# EAGLE design store-column-block (EAGLE 7.6.0)
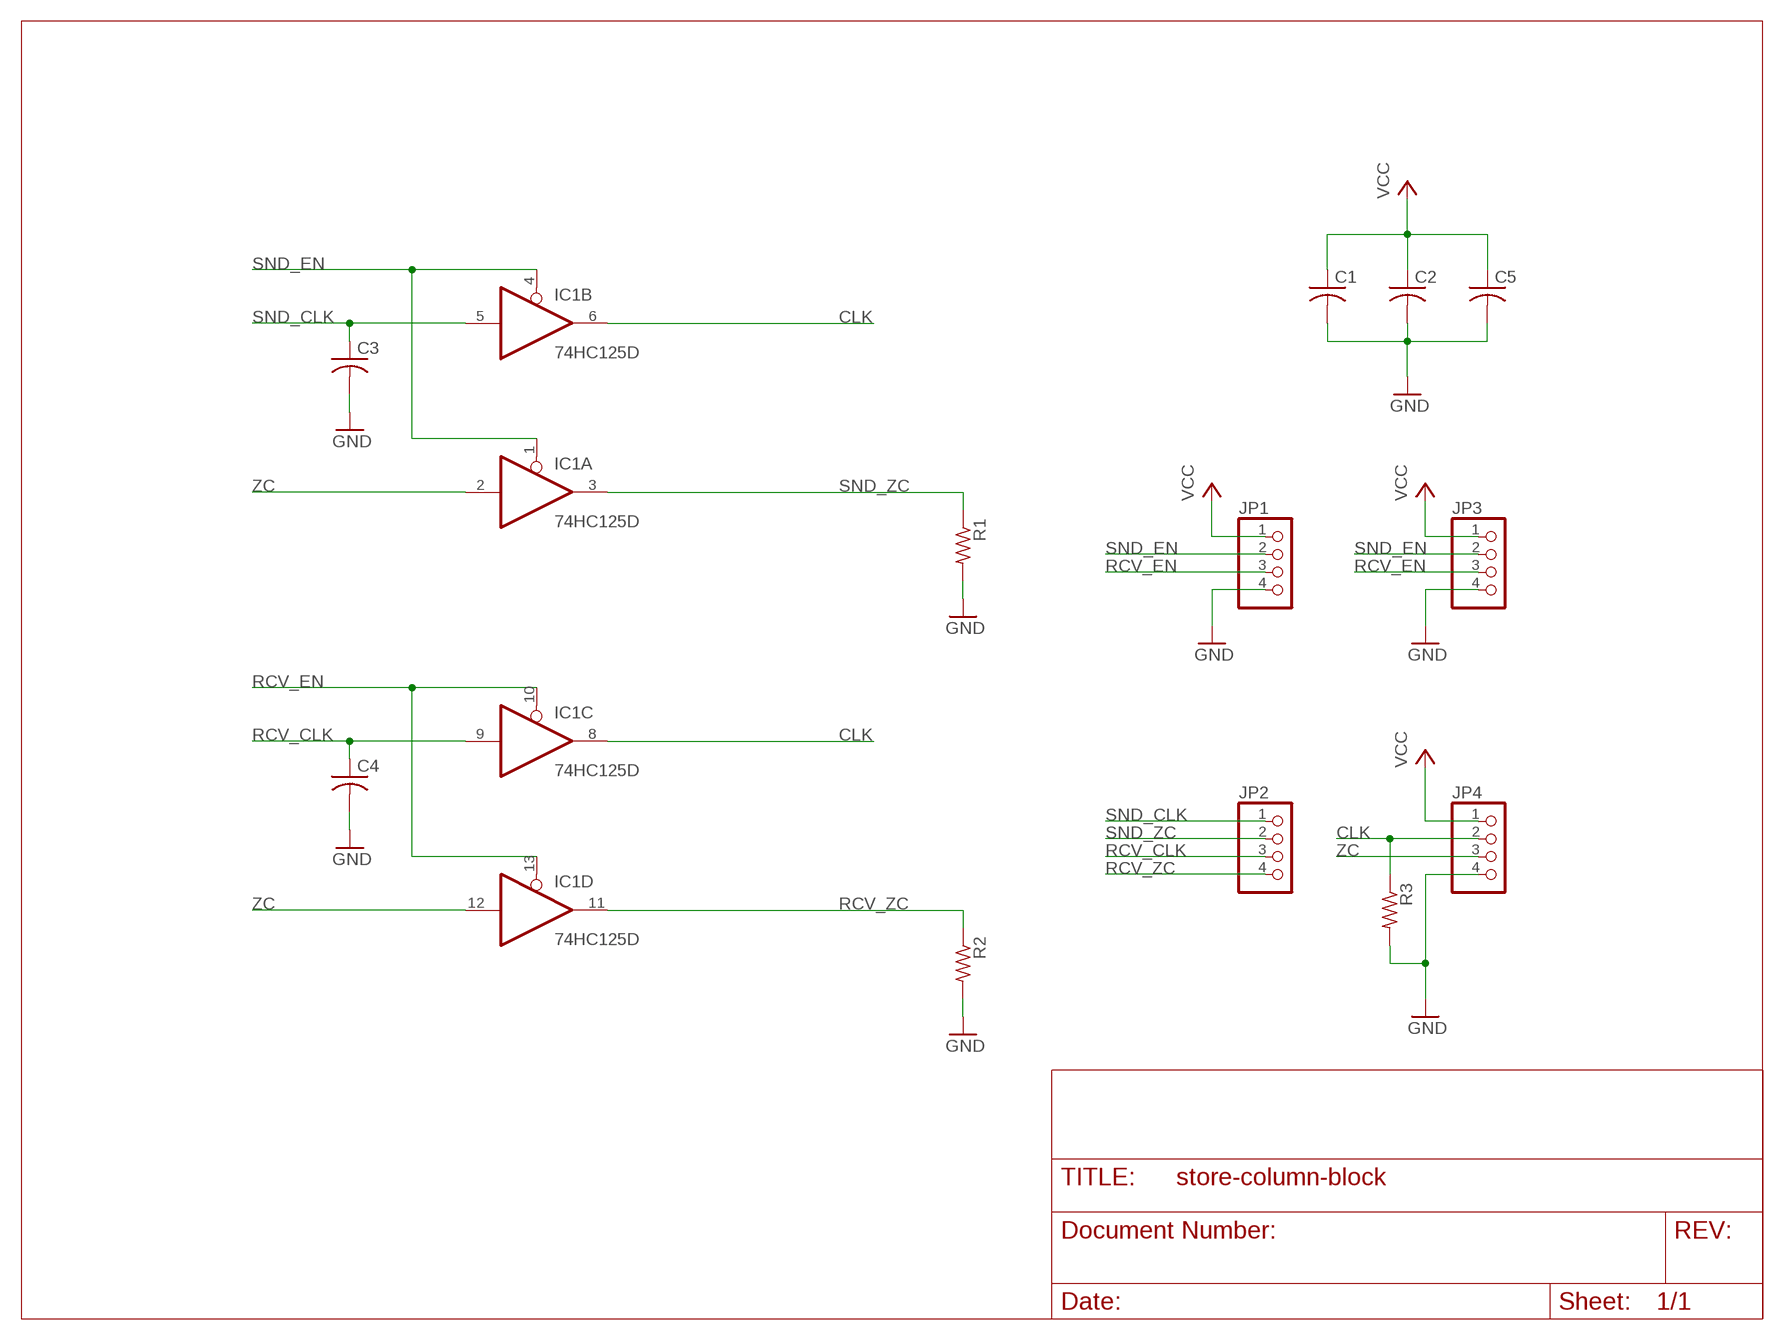
[diagram p0: schematic, sheet 1]

## Parts
C1  C-USC0603K  [C0603K]
C2  C-USC0603K  [C0603K]
C3  C-USC0603K  [C0603K]
C4  C-USC0603K  [C0603K]
C5  C-USC0603K  [C0603K]
IC1  74HC125D  [SO14]
JP1  PINHD-1X4  [1X04]
JP2  PINHD-1X4  [1X04]
JP3  PINHD-1X4  [1X04]
JP4  PINHD-1X4  [1X04]
R1  R-US_R0603  [R0603]
R2  R-US_R0603  [R0603]
R3  R-US_R0603  [R0603]

## Nets
CLK: IC1.6(B:O) IC1.8(C:O) JP4.2 R3.1
GND: C1.2 C2.2 C3.2 C4.2 C5.2 JP1.4 JP3.4 JP4.4 R1.2 R2.2 R3.2
RCV_CLK: C4.1 IC1.9(C:I) JP2.3
RCV_EN: IC1.10(C:OE) IC1.13(D:OE) JP1.3 JP3.3
RCV_ZC: IC1.11(D:O) JP2.4 R2.1
SND_CLK: C3.1 IC1.5(B:I) JP2.1
SND_EN: IC1.1(A:OE) IC1.4(B:OE) JP1.2 JP3.2
SND_ZC: IC1.3(A:O) JP2.2 R1.1
VCC: C1.1 C2.1 C5.1 JP1.1 JP3.1 JP4.1
ZC: IC1.2(A:I) IC1.12(D:I) JP4.3

## Power pins joined to a net without a drawn wire
GND: IC1.7(P:GND)
VCC: IC1.14(P:VCC)

## Library data of the parts
C1-C5 = resistor:C-US: CAPACITOR, American symbol
IC1 = 74xx-eu:74*125: Quad bus BUFFER, 3-state
JP1-JP4 = pinhead:PINHD-1X4: PIN HEADER
R1-R3 = resistor:R-US_: RESISTOR, American symbol

## Board
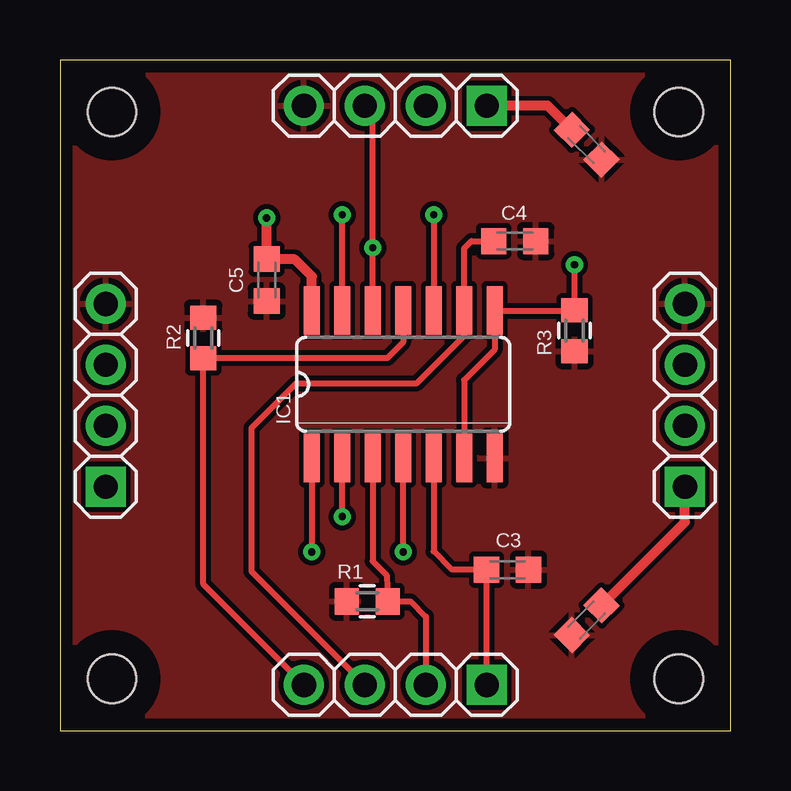
[diagram p1: board, top side]
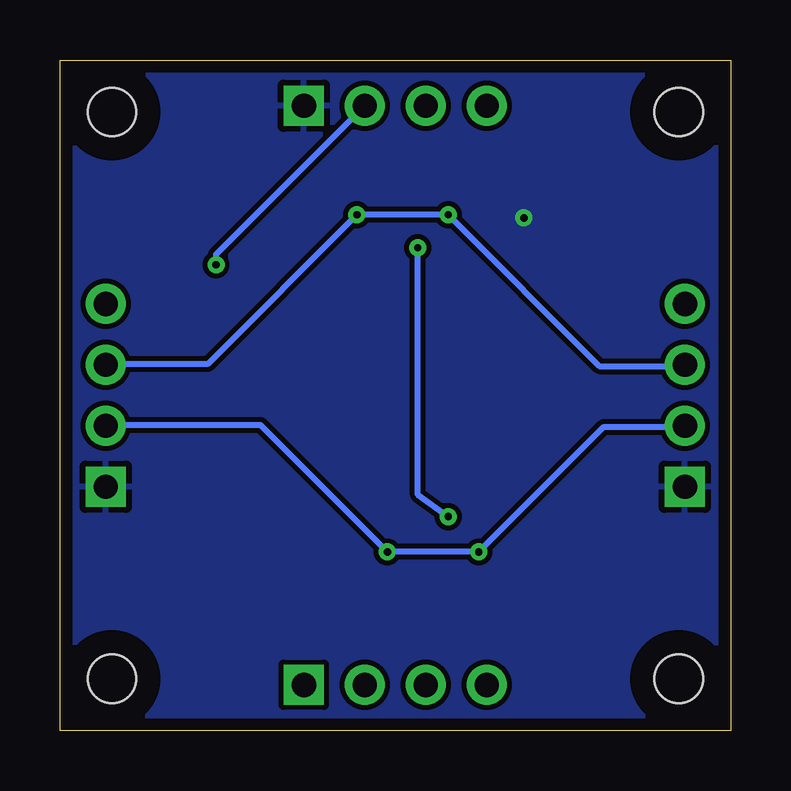
[diagram p2: board, bottom side, seen from below]

Size 27.94 x 27.94 mm. Coordinates in mm from the lower left corner, seen from the top.
Outline: 27.94,27.94 0,27.94 0,0 27.94,0 27.94,27.94
Copper layers (1*16): Top 0.035mm / dielectric 1.5mm / Bottom 0.035mm
Design rules "default *": minimum track width 8mil, minimum drill 12mil, track to track 8mil, track to pad 10mil, pad to pad 10mil, via to via 8mil, smd to smd 8mil, copper to edge 20mil, drill to drill 8mil, minimum pad ring 10mil, minimum via ring 8mil, stop-mask expansion 4mil, vias tented up to drill 0mil, thermal gap 10mil
Holes 2.01 mm at 2.16,2.16 25.78,2.16 25.78,25.78 2.16,25.78
tRestrict: area 23.8,0.2 to 27.8,4.2; area 23.8,23.8 to 27.8,27.8; area 0.2,23.8 to 4.2,27.8; area 0.2,0.2 to 4.2,4.2
bRestrict: area 23.8,0.2 to 27.8,4.2; area 23.8,23.8 to 27.8,27.8; area 0.2,23.8 to 4.2,27.8; area 0.2,0.2 to 4.2,4.2

### Footprints (pad centres in the part's own frame; a part is rotated, then mirrored left to right if it is on the bottom)
C0603K = smd 1.05 x 1.08: 1 -0.875,0; 2 0.875,0
SO14 = smd 0.66 x 2.032: 1 -3.81,-3.073; 2 -2.54,-3.073; 3 -1.27,-3.073; 4 0,-3.073; 5 1.27,-3.073; 6 2.54,-3.073; 7 3.81,-3.073; 8 3.81,3.073; 9 2.54,3.073; 10 1.27,3.073; 11 0,3.073; 12 -1.27,3.073; 13 -2.54,3.073; 14 -3.81,3.073
1X04 = drill 1.016 pad 1.676 square: 1 -3.81,0 | drill 1.016 pad 1.676: 2 -1.27,0; 3 1.27,0; 4 3.81,0
R0603 = smd 1 x 1.1: 1 -0.85,0; 2 0.85,0

### Placement (x,y rotation side)
C1  21.95,4.6 225 top
C2  21.95,24.41 315 top
C3  18.64,6.71 0 top
C4  18.95,20.4 0 top
C5  8.61,18.77 270 top
IC1  14.3,14.43 0 top
JP1  1.91,13.97 90 top
JP2  13.97,1.91 180 top
JP3  26.04,13.97 90 top
JP4  13.97,26.04 180 top
R1  12.8,5.38 180 top
R2  5.97,16.36 90 top
R3  21.44,16.66 270 top

### Tracks (layer width: path | path; a pad name or v marks a point on that pad's centre or on a via)
CLK  (via drill 0.3)
  Top 0.254: IC1.6 16.84,14.61 18.11,15.88 IC1.8 21.43,17.5 R3.1 v21.44,19.41
  Bottom 0.254: v21.44,19.41 21.44,19.84 JP4.2
GND
  pour Top: 27.69,0.25 0.25,0.25 0.25,27.69 27.69,27.69
RCV_CLK
  Top 0.254: JP2.3 7.98,6.63 7.98,12.6 9.83,14.45 14.83,14.45 16.84,16.46 IC1.9 16.84,20.09 17.14,20.4 C4.1
RCV_EN  (via drill 0.3)
  Top 0.254: IC1.13 v11.76,21.49 | v15.57,21.49 IC1.10
  Bottom 0.254: JP1.3 2.03,15.19 5.46,15.19 v11.76,21.49 v15.57,21.49 21.79,15.27 25.93,15.27 JP3.3
RCV_ZC
  Top 0.254: IC1.11 14.3,16.18 13.64,15.52 R2.1 5.97,6.1 JP2.4
SND_CLK
  Top 0.254: IC1.5 15.57,7.47 16.33,6.71 C3.1 17.78,6.69 JP2.1
SND_EN  (via drill 0.3)
  Top 0.254: IC1.1 v10.49,7.44 | v14.3,7.44 IC1.4
  Bottom 0.254: JP1.2 2.03,12.65 5.28,12.65 v10.49,7.44 v14.3,7.44 19.58,12.72 25.93,12.72 JP3.2
SND_ZC
  Top 0.254: IC1.3 13.03,7.06 13.61,6.48 R1.1 14.61,5.38 15.24,4.75 JP2.2
VCC  (via drill 0.3)
  Top 0.406: C2.1 20.32,26.04 JP4.1 | C1.1 26.04,8.69 JP3.1 | IC1.14 10.49,18.92 9.78,19.63 8.62,19.63 C5.1 v8.61,21.36
  pour Bottom: 27.69,0.25 0.25,0.25 0.25,27.69 27.69,27.69
ZC  (via drill 0.3)
  Top 0.254: IC1.12 v13.03,20.12 13.03,25.65 JP4.3 | v11.76,8.91 IC1.2
  Bottom 0.254: v13.03,20.12 13.03,9.83 v11.76,8.91

### Text on the board
Document: COL SEL